# Altium schematic sheet Morpheus_LED2.SchDoc: Morpheus LED
size Letter; Author: Ben Peng; DrawnBy: Ben Peng; Organization: Hello Inc.; Revision: DVT; SheetNumber: 2; SheetTotal: 2; ProjectName: Morpheus LED
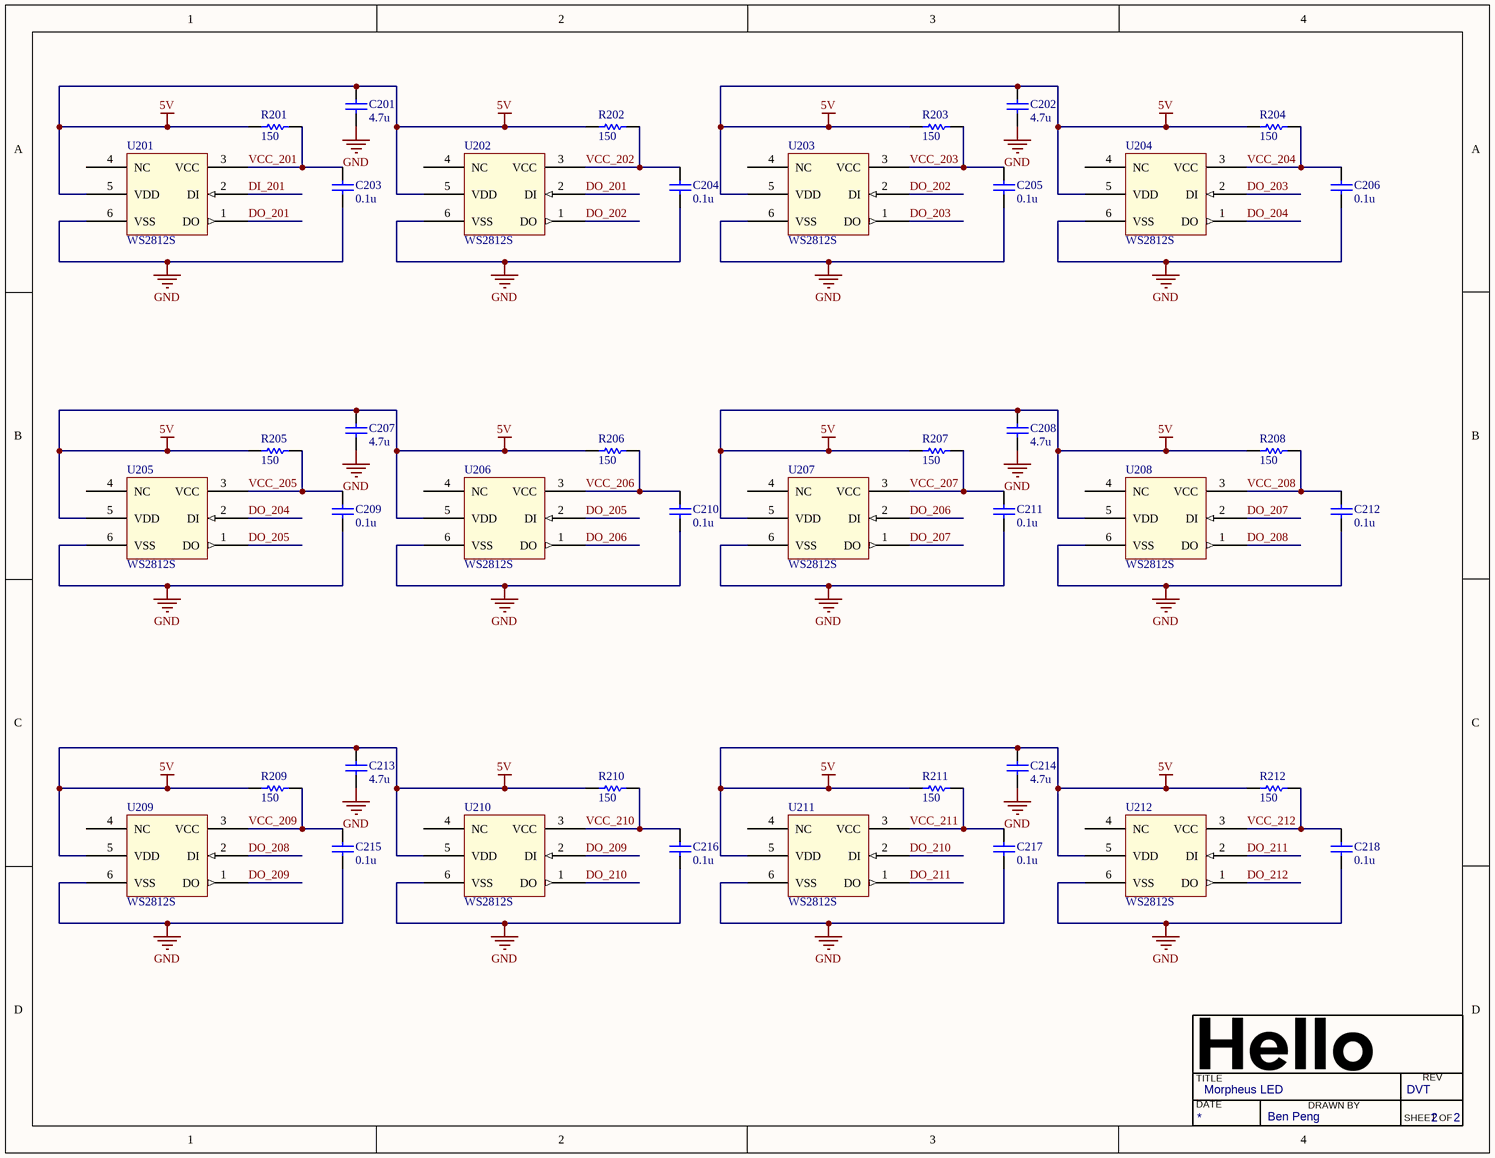
[diagram p0: Morpheus_LED2.SchDoc]

## Parts
C201  4.7u  [CAP0402_SENSE_DVT]
C202  4.7u  [CAP0402_SENSE_DVT]
C203  0.1u  [CAP0402_SENSE_DVT]
C204  0.1u  [CAP0402_SENSE_DVT]
C205  0.1u  [CAP0402_SENSE_DVT]
C206  0.1u  [CAP0402_SENSE_DVT]
C207  4.7u  [CAP0402_SENSE_DVT]
C208  4.7u  [CAP0402_SENSE_DVT]
C209  0.1u  [CAP0402_SENSE_DVT]
C210  0.1u  [CAP0402_SENSE_DVT]
C211  0.1u  [CAP0402_SENSE_DVT]
C212  0.1u  [CAP0402_SENSE_DVT]
C213  4.7u  [CAP0402_SENSE_DVT]
C214  4.7u  [CAP0402_SENSE_DVT]
C215  0.1u  [CAP0402_SENSE_DVT]
C216  0.1u  [CAP0402_SENSE_DVT]
C217  0.1u  [CAP0402_SENSE_DVT]
C218  0.1u  [CAP0402_SENSE_DVT]
R201  150  [RES0402_SENSE_DVT]
R202  150  [RES0402_SENSE_DVT]
R203  150  [RES0402_SENSE_DVT]
R204  150  [RES0402_SENSE_DVT]
R205  150  [RES0402_SENSE_DVT]
R206  150  [RES0402_SENSE_DVT]
R207  150  [RES0402_SENSE_DVT]
R208  150  [RES0402_SENSE_DVT]
R209  150  [RES0402_SENSE_DVT]
R210  150  [RES0402_SENSE_DVT]
R211  150  [RES0402_SENSE_DVT]
R212  150  [RES0402_SENSE_DVT]
U201  WS2812S  [6PIN_WS2812]
U202  WS2812S  [6PIN_WS2812]
U203  WS2812S  [6PIN_WS2812]
U204  WS2812S  [6PIN_WS2812]
U205  WS2812S  [6PIN_WS2812]
U206  WS2812S  [6PIN_WS2812]
U207  WS2812S  [6PIN_WS2812]
U208  WS2812S  [6PIN_WS2812]
U209  WS2812S  [6PIN_WS2812]
U210  WS2812S  [6PIN_WS2812]
U211  WS2812S  [6PIN_WS2812]
U212  WS2812S  [6PIN_WS2812]

## Nets
5V: C201.2 C202.2 C207.2 C208.2 C213.2 C214.2 R201.2 R202.2 R203.2 R204.2 R205.2 R206.2 R207.2 R208.2 R209.2 R210.2 R211.2 R212.2 U201.5(VDD) U202.5(VDD) U203.5(VDD) U204.5(VDD) U205.5(VDD) U206.5(VDD) U207.5(VDD) U208.5(VDD) U209.5(VDD) U210.5(VDD) U211.5(VDD) U212.5(VDD)
GND: C201.1 C202.1 C203.1 C204.1 C205.1 C206.1 C207.1 C208.1 C209.1 C210.1 C211.1 C212.1 C213.1 C214.1 C215.1 C216.1 C217.1 C218.1 U201.6(VSS) U202.6(VSS) U203.6(VSS) U204.6(VSS) U205.6(VSS) U206.6(VSS) U207.6(VSS) U208.6(VSS) U209.6(VSS) U210.6(VSS) U211.6(VSS) U212.6(VSS)
DI_201: U201.2(DI)
DO_201: U201.1(DO) U202.2(DI)
DO_202: U202.1(DO) U203.2(DI)
DO_203: U203.1(DO) U204.2(DI)
DO_204: U204.1(DO) U205.2(DI)
DO_205: U205.1(DO) U206.2(DI)
DO_206: U206.1(DO) U207.2(DI)
DO_207: U207.1(DO) U208.2(DI)
DO_208: U208.1(DO) U209.2(DI)
DO_209: U209.1(DO) U210.2(DI)
DO_210: U210.1(DO) U211.2(DI)
DO_211: U211.1(DO) U212.2(DI)
DO_212: U212.1(DO)
VCC_201: C203.2 R201.1 U201.3(VCC)
VCC_202: C204.2 R202.1 U202.3(VCC)
VCC_203: C205.2 R203.1 U203.3(VCC)
VCC_204: C206.2 R204.1 U204.3(VCC)
VCC_205: C209.2 R205.1 U205.3(VCC)
VCC_206: C210.2 R206.1 U206.3(VCC)
VCC_207: C211.2 R207.1 U207.3(VCC)
VCC_208: C212.2 R208.1 U208.3(VCC)
VCC_209: C215.2 R209.1 U209.3(VCC)
VCC_210: C216.2 R210.1 U210.3(VCC)
VCC_211: C217.2 R211.1 U211.3(VCC)
VCC_212: C218.2 R212.1 U212.3(VCC)

Not connected (* = marked no-connect by the designer): U201 4(NC); U202 4(NC); U203 4(NC); U204 4(NC); U205 4(NC); U206 4(NC); U207 4(NC); U208 4(NC); U209 4(NC); U210 4(NC); U211 4(NC); U212 4(NC)

## Notes on the sheet
- TITLE
- DATE
- DRAWN BY
- REV
- SHEET
- OF

## Library data of the parts
C201 C202 C207 C208 C213 C214 = C_4.7u_10_10_JB_0402: Chip capacitor; Vendor: TDK; PN: C1005JB1A475K050BC; Tolerance: 10%; Voltage: 10V; Temp: JB; Value: 4.7u; Size: 0402
C203-C206 C209-C212 C215-C218 = C_0.1u_10_50_X7R_0402: Chip capacitor; Vendor: Taiyo Yuden; PN: UMK105B7104KV-FR; Tolerance: 10%; Voltage: 50V; Temp: X7R; Value: 0.1u; Size: 0402
R201-R212 = R_150_1_0.1_0402: Chip Resistor; Vendor: Panasonic; Tolerance: 1 %; Power: 0.1 W; PN: ERJ-2RKF1500X; Model: *; Value: 150; Size: 0402
U201-U212 = WS2812S: WS2812S Intelligent control LED integrated light source; PN: HC-WS2812S LED; Vendor: Worldsemi Co., Limited